# EAGLE design pressureSensor (EAGLE 9.6.2)
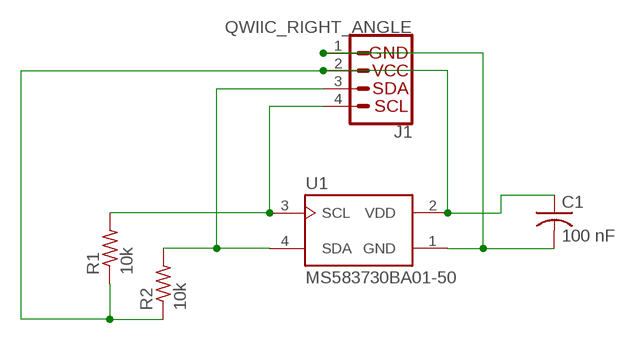
[diagram p0: schematic, sheet 1]

## Parts
C1  100 nF  C-USC1206  [C1206]
J1  QWIIC_RIGHT_ANGLE  QWIIC_CONNECTORJS-1MM  [JST04_1MM_RA]
R1  10k  R-US_M1206  [M1206]
R2  10k  R-US_M1206  [M1206]
U1  MS583730BA01-50  [TE_MS583730BA01-50]

## Nets
GND: C1.2 J1.1 U1.1(GND)
N$1: J1.4 R1.2 U1.3(SCL)
N$2: C1.1 J1.2 R1.1 R2.1 U1.2(VDD)
N$5: J1.3 R2.2 U1.4(SDA)

## Library data of the parts
C1 = rcl:C-US: CAPACITOR, American symbol; SPICEPREFIX: C
J1 = SparkFun-Connectors:QWIIC_CONNECTOR: SparkFun I2C Standard Qwiic Connector An SMD 1mm pitch JST connector makes it easy and quick (get it? Qwiic?) to connect I2C devices to each other. The Qwiic system <http://www.sparkfun.com/qwiic> enables fast and solderless connection between popular platforms and various sensors and actuators. We carry 200mm <https://www.sparkfun.com/products/14204>, 100mm <https://www.sparkfun.com/products/14205>, 50mm <https://www.sparkfun.com/products/14206>, and breadboard friendly <https://www.sparkfun.com/products/14207> Qwiic cables. We also offer 10 pcs strips <https://www.sparkfun.com/products/14323> the SMD connectors.; PROD_ID: CONN-13694
R1 R2 = rcl:R-US_: RESISTOR, American symbol; SPICEPREFIX: R
U1 = MS583730BA01-50:MS583730BA01-50: SENSOR PRESSURE UNDERWATER; COMMENT: MS583730BA01-50; DESCRIPTION: Waterproof Digital Pressure Ms583730ba01-50; DIGI-KEY_PART_NUMBER: 223-1704-1-ND; MF: TE Connectivity; MP: MS583730BA01-50; PACKAGE: SMD-4 TE Connectivity ALCOSWITCH Switches; PURCHASE-URL: https://pricing.snapeda.com/search/part/MS583730BA01-50/?ref=eda

## Board
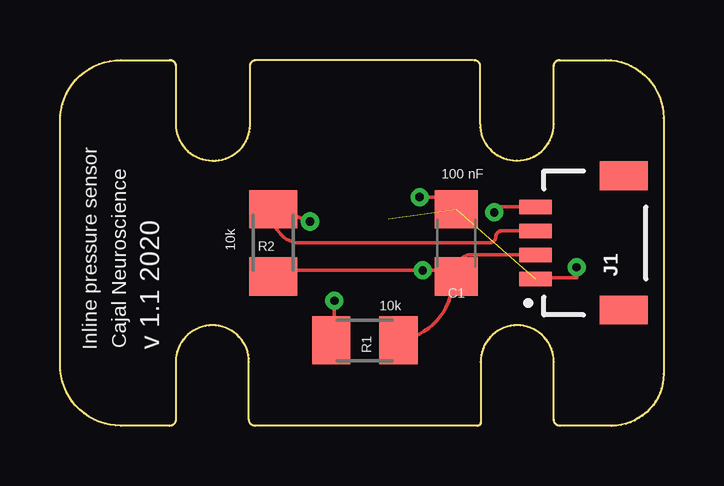
[diagram p1: board, top side]
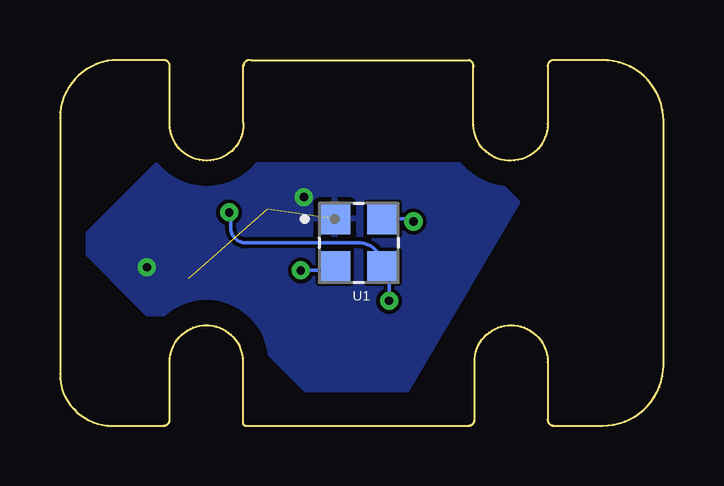
[diagram p2: board, bottom side, seen from below]

Size 25.15 x 15.24 mm. Coordinates in mm from the lower left corner, seen from the top.
Outline: 19.05,11.05 arc90 20.57,12.57 20.57,14.99 arc-90 20.83,15.24 22.73,15.24 arc-90 25.15,12.83 25.15,2.16 arc-90 22.99,0 20.83,0 arc-90 20.57,0.25 20.57,2.67 arc90 19.05,4.19 arc90 17.53,2.67 17.53,0.13 arc-90 17.4,0 8.13,0 arc-90 7.87,0.25 7.87,2.67 arc90 6.35,4.19 arc90 4.83,2.67 4.83,0.25 arc-90 4.57,0 2.54,0 arc-90 0,2.54 0,12.7 arc-90 2.54,15.24 4.57,15.24 arc-90 4.83,14.99 4.83,12.57 arc90 6.35,11.05 arc90 7.92,12.52 7.92,14.94 arc-90 8.13,15.24 17.2,15.24
Outline: 17.25,15.24 arc-90 17.5,14.99
Outline: 17.5,12.62 17.5,15.04
Outline: 17.5,12.57 arc90 19.02,11.05
Copper layers (1*16): Top 0.035mm / dielectric 1.5mm / Bottom 0.035mm
Design rules "default": minimum track width 6mil, minimum drill 0.35mm, track to track 6mil, track to pad 6mil, pad to pad 6mil, via to via 6mil, smd to smd 6mil, copper to edge 40mil, drill to drill 6mil, minimum pad ring 10mil, minimum via ring 8mil, stop-mask expansion 4mil, vias tented up to drill 0mil, thermal gap 10mil

### Footprints (pad centres in the part's own frame; a part is rotated, then mirrored left to right if it is on the bottom)
C1206 = smd 1.6 x 1.8: 1 -1.4,0; 2 1.4,0
JST04_1MM_RA = smd 0.6 x 1.35: 1 -1.5,0; 2 -0.5,0; 3 0.5,0; 4 1.5,0 | smd 1.2 x 2: NC1 2.8,-3.675; NC2 -2.8,-3.675
M1206 = smd 1.6 x 2: 1 -1.4,0; 2 1.4,0
TE_MS583730BA01-50 = smd 1.3 x 1.3: 1 -1,1; 2 -1,-1; 3 1,-1; 4 1,1

### Placement (x,y rotation side)
C1  16.51,7.62 90 top
J1  19.81,7.62 90 top
R1  12.7,3.56 180 top
R2  8.89,7.62 90 top
U1  12.7,7.62 0 bottom

### Tracks (layer width: path | path; a pad name or v marks a point on that pad's centre or on a via)
GND  (via drill 0.35)  (2 unrouted)
  Top 0.152: J1.1 arc-90 19.85,6.16 21.53,6.16 v21.53,6.6 | C1.2 16,9.53 v14.99,9.53
  pour Bottom: 6.03,9.33 10.67,1.46 10.67,1.46 14.92,1.46 18.1,4.64 21.53,4.64 24.48,7.59 21.15,10.92 7.62,10.92
N$1  (via drill 0.35)
  Top 0.152: R1.2 arc-90 11.43,3.88 v11.43,5.21 | v18.09,8.89 arc-90 18.32,9.12 J1.4
  Bottom 0.152: v11.43,5.21 11.43,6.35 arc-90 U1.3 arc-90 12.7,7.62 17.4,7.62 arc90 18.03,8.26 18.03,8.83 arc90 v18.09,8.89
N$2  (via drill 0.35)
  Top 0.152: J1.2 17.01,7.12 arc90 C1.1 arc-90 16.37,6.48 | 16.37,6.48 v15.11,6.48 9.08,6.48 arc-90 R2.1 | R1.1 13.83,3.56 arc90 16.37,6.1 16.37,6.48
  Bottom 0.152: v15.11,6.48 13.84,6.48 arc-90 U1.2
N$5  (via drill 0.35)
  Top 0.152: J1.3 18.41,8.12 arc90 18.16,7.87 arc-90 17.91,7.62 9.84,7.62 arc-90 R2.2 10.35,8.57 arc-90 v10.41,8.51
  Bottom 0.152: 11.68,8.64 arc90 U1.4 10.53,8.62 arc90 v10.41,8.51

### Text on the board
tNames: Inline pressure sensor | Cajal Neuroscience | v 1.1 2020